# Altium project Op Amplifier.PrjPcb
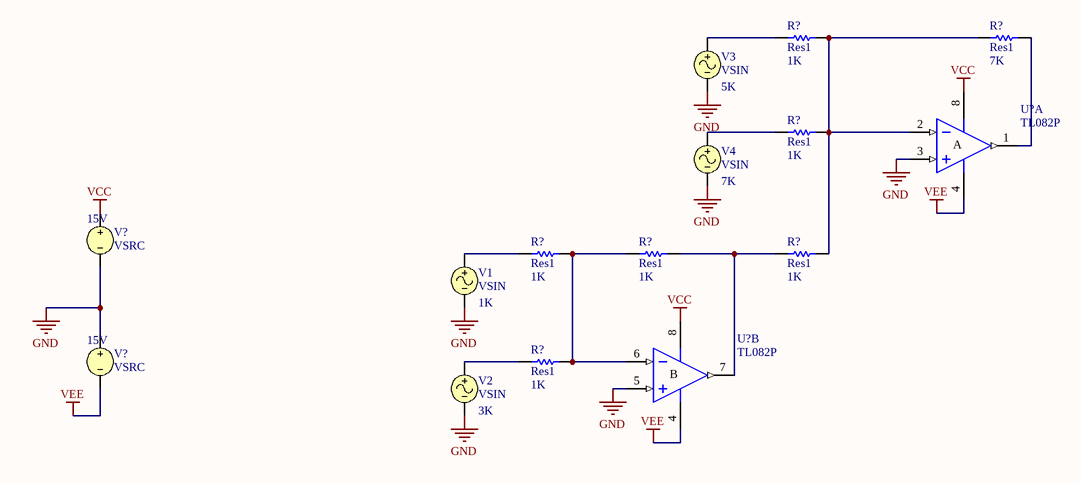
[diagram p0: Sheet1.SchDoc]
1 sheet, 15 parts. Net scope: global (net labels, ports and power ports of the same name join across sheets).

## Sheet Sheet1.SchDoc
size A4

### Parts
(Parts that share a designator on the sheet are numbered #1, #2 ... from top to bottom, then left to right.)
R?#1  Res1  value 1K  [AXIAL-0.3]
R?#2  Res1  value 7K  [AXIAL-0.3]
R?#3  Res1  value 1K  [AXIAL-0.3]
R?#4  Res1  value 1K  [AXIAL-0.3]
R?#5  Res1  value 1K  [AXIAL-0.3]
R?#6  Res1  value 1K  [AXIAL-0.3]
R?#7  Res1  value 1K  [AXIAL-0.3]
U?#1  TL082P  [P008]  (part A of 2)
U?#2  TL082P  [P008]  (part B of 2)
V1  VSIN  Frequency: 1K
V2  VSIN  Frequency: 3K
V3  VSIN  Frequency: 5K
V4  VSIN  Frequency: 7K
V?#1  VSRC  value 15V
V?#2  VSRC  value 15V

### Nets
GND: U?#1.3(IN+) U?#2.5(IN+) V1.2 V2.2 V3.2 V4.2 V?#1.2 V?#2.1
VCC: U?#1.8(V+) U?#2.8(V+) V?#1.1
VEE: U?#1.4(V-) U?#2.4(V-) V?#2.2
NetR?#1_1: R?#1.1 V3.1
NetR?#1_2: R?#1.2 R?#2.1 R?#3.2 R?#6.2 U?#1.2(IN-)
NetR?#2_2: R?#2.2 U?#1.1(OUT)
NetR?#3_1: R?#3.1 V4.1
NetR?#4_1: R?#4.1 V1.1
NetR?#4_2: R?#4.2 R?#5.1 R?#7.2 U?#2.6(IN-)
NetR?#5_2: R?#5.2 R?#6.1 U?#2.7(OUT)
NetR?#7_1: R?#7.1 V2.1

### Notes on the sheet
- (in symbol TL082P, part A) A
- (in symbol TL082P, part B) B

### Library data of the parts
R?#1-R?#7 = Res1: Resistor; Published: 8-Jun-2000; LatestRevisionDate: 17-Jul-2002; LatestRevisionNote: Re-released for DXP Platform.; PackageReference: AXIAL-0.3; Publisher: Altium Limited; PackageDescription: Axial Device, Thru-Hole; 2 Leads; 0.3 in Pin Spacing
U?#1 U?#2 = TL082P: JFET-Input Operational Amplifier; Published: 16-Jan-2001; LatestRevisionDate: 04-Mar-2005; LatestRevisionNote: Stylized 3D Model Added.; DatasheetVersion: Feb-1999; PackageVersion: Jun-1999; PackageReference: P008; Publisher: Altium Limited; PackageDescription: DIP; 8 Leads; Row Spacing 7.62 mm; Pitch 2.54 mm; Code_JEDEC: MO-001-AN; ComponentLink1Description: Manufacturer Link; ComponentLink1URL: http://www.ti.com/; ComponentLink2Description: Datasheet; ComponentLink2URL: http://www-s.ti.com/sc/ds/tl082.pdf
V1-V4 = VSIN: Sinusoidal Voltage Source; Note: PCB Footprint - Not required; Published: 8-Jun-2000; LatestRevisionDate: 15-Nov-2004; LatestRevisionNote: Corrected Netlist.; PackageReference: Not Applicable; Publisher: Altium Limited
V?#1 V?#2 = VSRC: Voltage Source; Note: PCB Footprint - Not required; Published: 8-Jun-2000; LatestRevisionDate: 17-Jul-2002; LatestRevisionNote: Re-released for DXP Platform.; PackageReference: Not Applicable; Publisher: Altium Limited